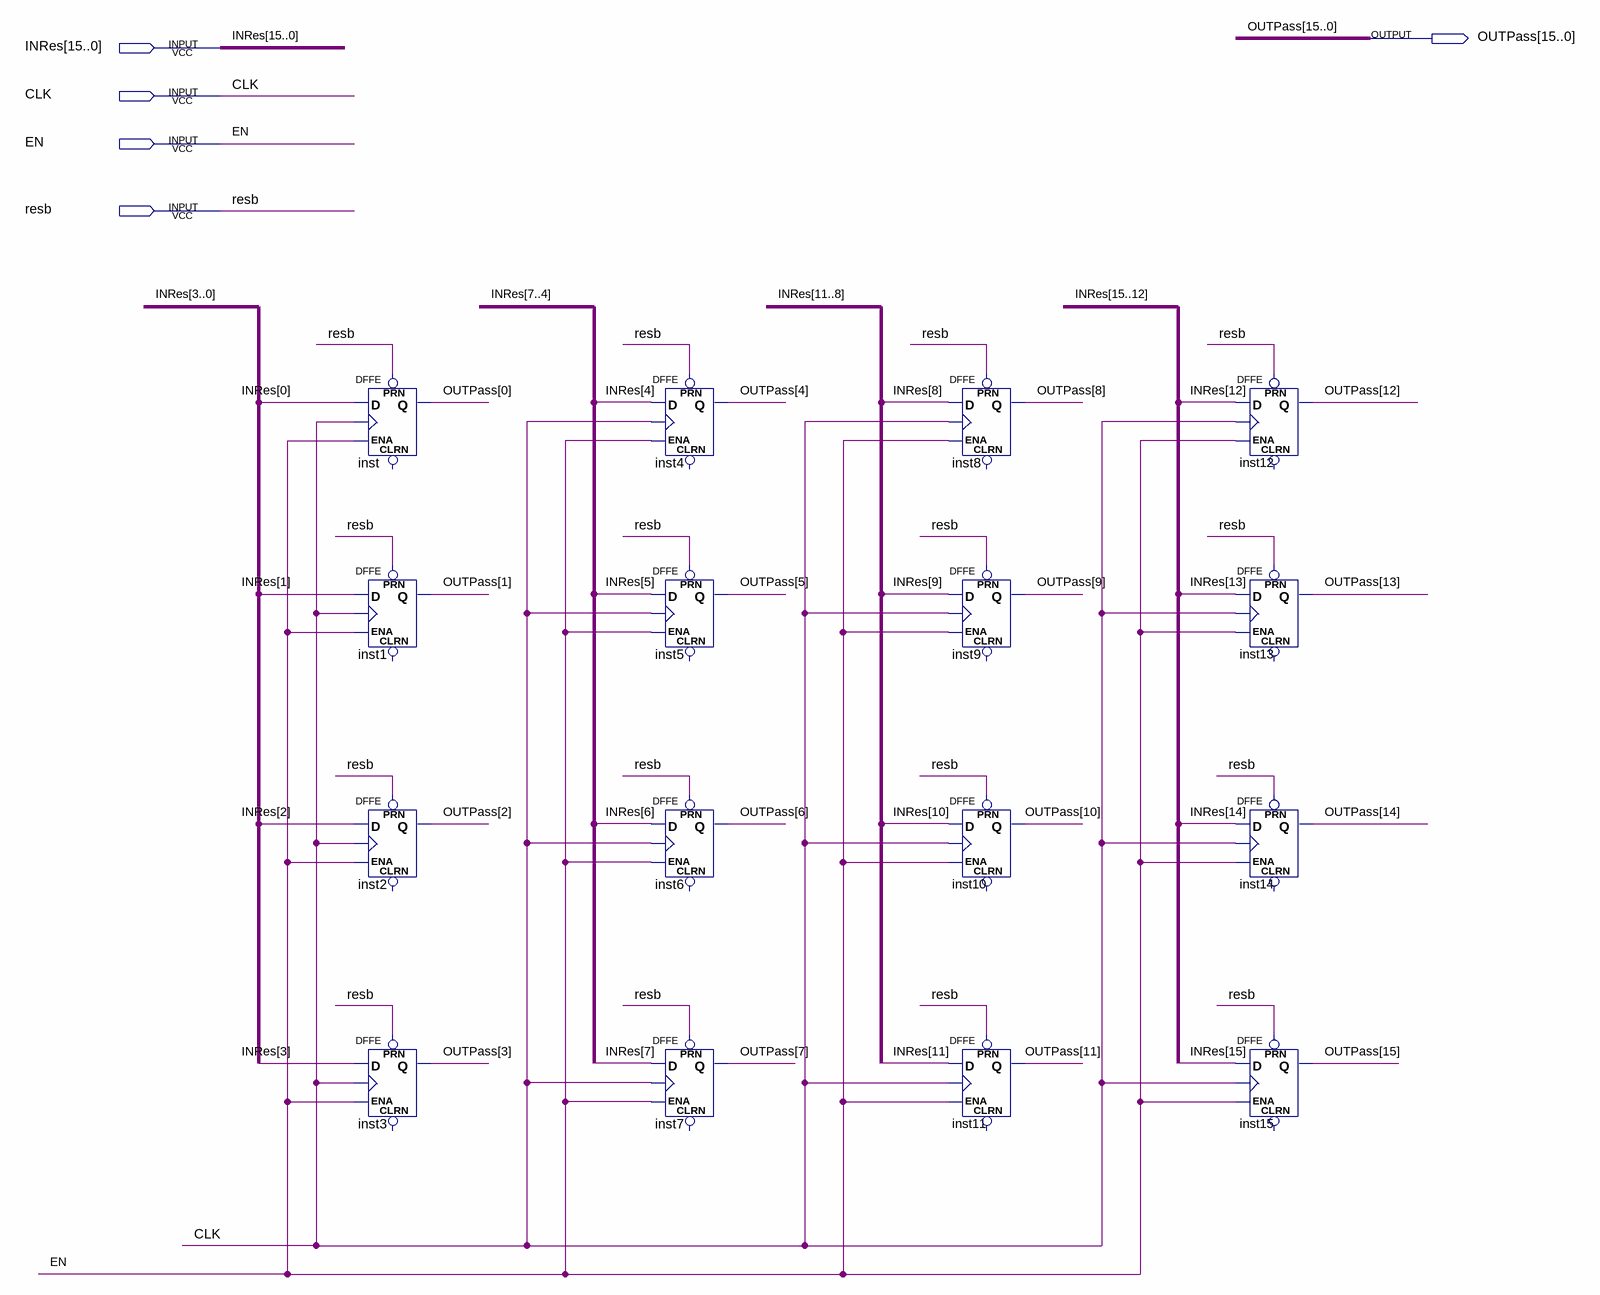
[diagram p0: schematic sheet]
// Quartus schematic angoRegister.bdf as structural Verilog: 16 symbols, 5 pins
module angoRegister (
  input  [15:0] INRes,
  input  CLK,
  input  EN,
  input  resb,
  output [15:0] OUTPass
);

  DFFE inst (.PRN(resb), .D(INRes[0]), .CLK(CLK), .ENA(EN), .Q(OUTPass[0]));  // open: CLRN
  DFFE inst1 (.PRN(resb), .D(INRes[1]), .CLK(CLK), .ENA(EN), .Q(OUTPass[1]));  // open: CLRN
  DFFE inst2 (.PRN(resb), .D(INRes[2]), .CLK(CLK), .ENA(EN), .Q(OUTPass[2]));  // open: CLRN
  DFFE inst3 (.PRN(resb), .D(INRes[3]), .CLK(CLK), .ENA(EN), .Q(OUTPass[3]));  // open: CLRN
  DFFE inst4 (.PRN(resb), .D(INRes[4]), .CLK(CLK), .ENA(EN), .Q(OUTPass[4]));  // open: CLRN
  DFFE inst5 (.PRN(resb), .D(INRes[5]), .CLK(CLK), .ENA(EN), .Q(OUTPass[5]));  // open: CLRN
  DFFE inst6 (.PRN(resb), .D(INRes[6]), .CLK(CLK), .ENA(EN), .Q(OUTPass[6]));  // open: CLRN
  DFFE inst7 (.PRN(resb), .D(INRes[7]), .CLK(CLK), .ENA(EN), .Q(OUTPass[7]));  // open: CLRN
  DFFE inst8 (.PRN(resb), .D(INRes[8]), .CLK(CLK), .ENA(EN), .Q(OUTPass[8]));  // open: CLRN
  DFFE inst9 (.PRN(resb), .D(INRes[9]), .CLK(CLK), .ENA(EN), .Q(OUTPass[9]));  // open: CLRN
  DFFE inst10 (.PRN(resb), .D(INRes[10]), .CLK(CLK), .ENA(EN), .Q(OUTPass[10]));  // open: CLRN
  DFFE inst11 (.PRN(resb), .D(INRes[11]), .CLK(CLK), .ENA(EN), .Q(OUTPass[11]));  // open: CLRN
  DFFE inst12 (.PRN(resb), .D(INRes[12]), .CLK(CLK), .ENA(EN), .Q(OUTPass[12]));  // open: CLRN
  DFFE inst13 (.PRN(resb), .D(INRes[13]), .CLK(CLK), .ENA(EN), .Q(OUTPass[13]));  // open: CLRN
  DFFE inst14 (.PRN(resb), .D(INRes[14]), .CLK(CLK), .ENA(EN), .Q(OUTPass[14]));  // open: CLRN
  DFFE inst15 (.PRN(resb), .D(INRes[15]), .CLK(CLK), .ENA(EN), .Q(OUTPass[15]));  // open: CLRN
endmodule
